# EAGLE design DC_brake(PIC) (EAGLE 7.4.0)
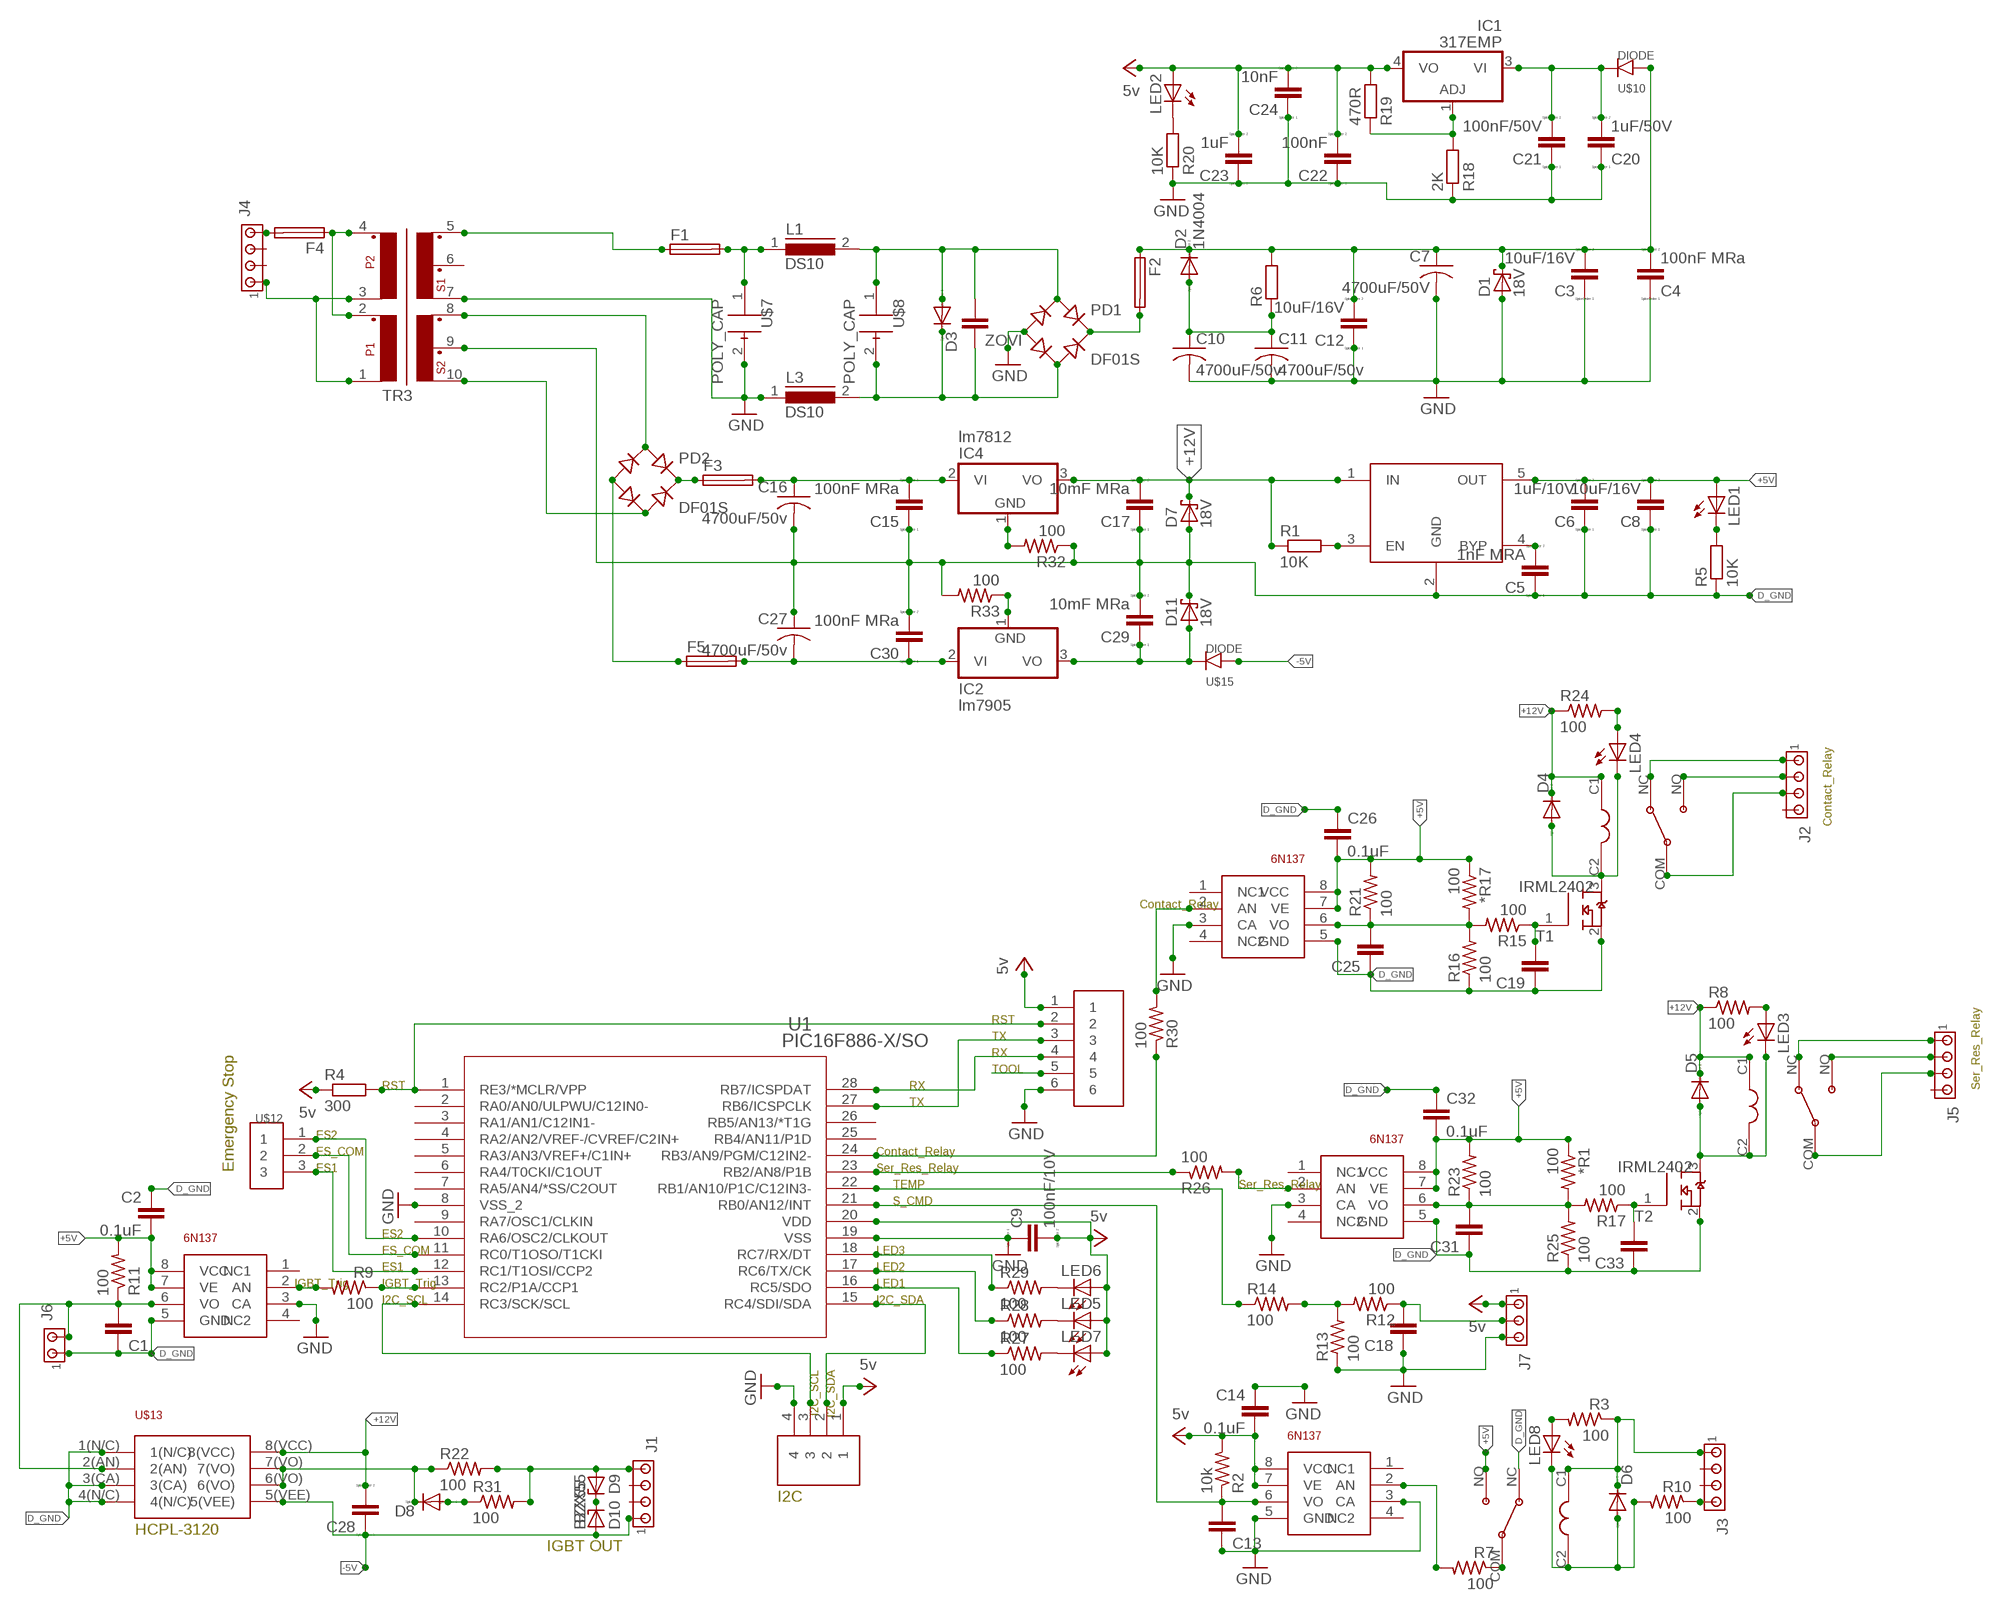
[diagram p0: schematic, sheet 1]

## Parts
*R1  100  R-US_R0603  [R0603]
*R17  100  R-US_R0603  [R0603]
C1  C-EUC0603  [C0603]
C2  0.1uF  C-EUC0603  [C0603]
C3  10uF/16V  CC1206  [C1206]
C4  100nF MRa  CC0603  [C0603]
C5  1nF MRA  CC0603  [C0603]
C6  1uF/10V  CC0603  [C0603]
C7  4700uF/50V  C-US050-075X075  [C050-075X075]
C8  10uF/16V  CC1206  [C1206]
C9  100nF/10V  CC0603  [C0603]
C10  4700uF/50v  C-US050-075X075  [C050-075X075]
C11  4700uF/50v  C-US050-075X075  [C050-075X075]
C12  10uF/16V  CC1206  [C1206]
C13  C-EUC0603  [C0603]
C14  0.1uF  C-EUC0603  [C0603]
C15  100nF MRa  CC0603  [C0603]
C16  4700uF/50v  C-US050-075X075  [C050-075X075]
C17  10mF MRa  CC0603  [C0603]
C18  C-EUC0603  [C0603]
C19  C-EUC0603  [C0603]
C20  1uF/50V  CC1206  [C1206]
C21  100nF/50V  CC0603  [C0603]
C22  100nF  CC0603  [C0603]
C23  1uF  CC0603  [C0603]
C24  10nF  CC0603  [C0603]
C25  C-EUC0603  [C0603]
C26  0.1uF  C-EUC0603  [C0603]
C27  4700uF/50v  C-US050-075X075  [C050-075X075]
C28  C  [C0805]
C29  10mF MRa  CC0603  [C0603]
C30  100nF MRa  CC0603  [C0603]
C31  C-EUC0603  [C0603]
C32  0.1uF  C-EUC0603  [C0603]
C33  C-EUC0603  [C0603]
D1  18V  SCHOTTKY-DIODESMC  [SMC]
D2  1N4004  [DO41-10]
D3  1N4933  [DO41-10]
D4  DIODE-DO214AC  [DO214AC]
D5  DIODE-DO214AC  [DO214AC]
D6  DIODE-DO214AC  [DO214AC]
D7  18V  SCHOTTKY-DIODESMC  [SMC]
D8  DIODE-DO214AC  [DO214AC]
D9  BZX55  [DO35Z10]
D10  BZX55  [DO35Z10]
D11  18V  SCHOTTKY-DIODESMC  [SMC]
F1  19560  [19560]
F2  19560  [19560]
F3  19560  [19560]
F4  19560  [19560]
F5  19560  [19560]
IC1  317EMP  [SOT223]
IC2  lm7905  7908T  [TO220H]
IC4  lm7812  7908T  [TO220H]
J1  MTA04-156  [1X4MTA]
J2  MTA04-156  [1X4MTA]
J3  MTA04-156  [1X4MTA]
J4  MTA04-156  [1X4MTA]
J5  MTA04-156  [1X4MTA]
J6  MTA02-100  [10X02MTA]
J7  MTA03-100  [10X03MTA]
L1  DS10  [DS10]
L3  DS10  [DS10]
LED1  LEDSML1206  [SML1206]
LED2  LEDSML1206  [SML1206]
LED3  LED3MM  [LED3MM]
LED4  LED3MM  [LED3MM]
LED5  LED3MM  [LED3MM]
LED6  LED3MM  [LED3MM]
LED7  LED3MM  [LED3MM]
LED8  LED3MM  [LED3MM]
PD1  DF01S  DBLS201G  [DBS]
PD2  DF01S  DBLS201G  [DBS]
R1  10K  R-EU_R0603  [R0603]
R2  10k  R-US_R0603  [R0603]
R3  100  R-US_R0603  [R0603]
R4  300  R-EU_R0603  [R0603]
R5  10K  R-EU_R0603  [R0603]
R6  R-EU_0411/12  [0411/12]
R7  100  R-US_R0603  [R0603]
R8  100  R-US_R0603  [R0603]
R9  100  R-US_R0603  [R0603]
R10  100  R-US_R0603  [R0603]
R11  100  R-US_R0603  [R0603]
R12  100  R-US_R0603  [R0603]
R13  100  R-US_R0603  [R0603]
R14  100  R-US_R0603  [R0603]
R15  100  R-US_R0603  [R0603]
R16  100  R-US_R0603  [R0603]
R17  100  R-US_R0603  [R0603]
R18  2K  R-EU_R0603  [R0603]
R19  470R  R-EU_R0603  [R0603]
R20  10K  R-EU_R0603  [R0603]
R21  100  R-US_R0603  [R0603]
R22  100  R-US_R0603  [R0603]
R23  100  R-US_R0603  [R0603]
R24  100  R-US_R0603  [R0603]
R25  100  R-US_R0603  [R0603]
R26  100  R-US_R0603  [R0603]
R27  100  R-US_R0603  [R0603]
R28  100  R-US_R0603  [R0603]
R29  100  R-US_R0603  [R0603]
R30  100  R-US_R0603  [R0603]
R31  100  R-US_R0603  [R0603]
R32  100  R-US_R0603  [R0603]
R33  100  R-US_R0603  [R0603]
T1  IRML2402  [IRML2402]
T2  IRML2402  [IRML2402]
TR3  OB115/6M  [OB115/6M]
U1  PIC16F886-X/SO  PIC16F883-X/SO  [SOIC28-W_MC]
U$1  MIC5205-5.YMS  [SMD]
U$2  6N137  [6N137]
U$3  6N137  [6N137]
U$4  6PIN  [6PIN]
U$5  RELAY  [RELAY]
U$6  4PIN  [4PIN]
U$7  POLY_CAP  [POL_CAP]
U$8  POLY_CAP  [POL_CAP]
U$9  RELAY  [RELAY]
U$10  DIODE  [DIODE]
U$11  6N137  [6N137]
U$12  3PIN  [3PIN]
U$13  HCPL-3120  [HCPL-3120]
U$14  6N137  [6N137]
U$15  DIODE  [DIODE]
U$16  RELAY  [RELAY]
ZOVI  C5/7.2  [C5B7.2]

## Nets
+5V: *R1.1 *R17.1 C2.2 C6.2 C8.2 C26.2 C32.2 LED1.A R11.2 R21.2 R23.2 U$1.5(OUT) U$3.7(VE) U$3.8(VCC) U$5.NO U$11.7(VE) U$11.8(VCC) U$14.7(VE) U$14.8(VCC)
+12V: C17.2 C28.2 D4.C D5.C D7.C IC4.3(VO) R1.1 R8.1 R24.1 U$1.1(IN) U$9.C1 U$13.8(VCC) U$16.C1
-5V: C28.1 D10.A J1.1 U$13.5(VEE) U$15.-(+)
CONTACT_RELAY: R30.1 U1.24(RB3/AN9/PGM/C12IN2-)
D_GND: C1.1 C2.1 C5.1 C6.1 C8.1 C15.1 C16.2 C17.1 C19.1 C25.1 C26.1 C27.1 C29.2 C30.2 C31.1 C32.1 C33.1 D7.A D11.C J6.1 R5.1 R16.1 R25.1 R32.1 R33.2 T1.2(S1) T2.2(S1) TR3.9 U$1.2(GND) U$3.5(GND) U$5.NC U$11.5(GND) U$13.1(N/C) U$13.3(CA) U$13.4(N/C) U$14.5(GND)
ES1: U1.12(RC1/T1OSI/CCP2) U$12.3
ES2: U1.10(RA6/OSC2/CLKOUT) U$12.1
ES_COM: U1.11(RC0/T1OSO/T1CKI) U$12.2
GND: C3.1 C4.1 C7.2 C9.1 C10.2 C11.2 C12.1 C13.1 C14.1 C18.1 C20.1 C21.1 C22.1 C23.1 C24.1 D1.A J7.3 L3.1 PD1.- R13.1 R18.1 R20.1 TR3.7 U1.8(VSS_2) U1.19(VSS) U$2.3(CA) U$2.5(GND) U$3.3(CA) U$4.6 U$6.4 U$7.2 U$11.3(CA) U$14.3(CA)
I2C_SCL: U1.14(RC3/SCK/SCL) U$6.3
I2C_SDA: U1.15(RC4/SDI/SDA) U$6.2
IGBT_TRIG: R9.1 U1.13(RC2/P1A/CCP1)
LED1: R27.1 U1.16(RC5/SDO)
LED2: R28.1 U1.17(RC6/TX/CK)
LED3: R29.1 U1.18(RC7/RX/DT)
N$1: C29.1 D11.A IC2.3(VO) U$15.+(-)
N$2: C5.2 U$1.4(BYP)
N$3: F1.2 L1.1 U$7.1
N$4: R1.2 U$1.3(EN)
N$5: F4.1 TR3.2 TR3.4
N$6: F1.1 TR3.5
N$7: J4.1 TR3.1 TR3.3
N$8: F4.2 J4.4
N$9: D9.A J1.4 R22.2 R31.2
N$10: C10.1 C11.1 D2.A R6.1
N$11: PD2.AC2 TR3.10
N$12: J2.1 U$9.NC
N$13: C3.2 C4.2 C7.1 C12.2 D1.C D2.C F2.1 R6.2 U$10.-(+)
N$14: LED1.C R5.2
N$15: D6.A LED8.K(C) R10.2 U$5.C2
N$16: LED8.A R3.2
N$17: R7.2 U$2.2(AN)
N$18: R7.1 U$5.COM
N$19: D6.C J3.1 R3.1 U$5.C1
N$20: D5.A LED3.K(C) T2.3(D1) U$16.C2
N$21: LED3.A R8.2
N$22: J5.1 U$16.NC
N$23: J5.2 U$16.NO
N$24: J5.3 U$16.COM
N$25: R9.2 U$3.2(AN)
N$26: PD2.AC1 TR3.8
N$27: D3.A L1.2 PD1.AC1 U$8.1 ZOVI.2
N$28: D3.C L3.2 PD1.AC2 U$8.2 ZOVI.1
N$29: C27.2 C30.1 F5.2 IC2.2(VI)
N$30: J2.2 U$9.NO
N$31: C1.2 J6.2 R11.1 U$3.6(VO) U$13.2(AN)
N$32: C15.2 C16.1 F3.2 IC4.2(VI)
N$33: C18.2 J7.2 R12.1
N$34: J2.3 U$9.COM
N$35: F2.2 PD1.+
N$36: R26.2 U$14.2(AN)
N$37: R12.2 R13.2 R14.2
N$38: C19.2 R15.1 T1.1(G1)
N$39: D4.A LED4.K(C) T1.3(D1) U$9.C2
N$40: C33.2 R17.1 T2.1(G1)
N$41: *R17.2 C25.2 R15.2 R16.2 R21.1 U$11.6(VO)
N$42: LED2.C R20.2
N$43: IC1.1(ADJ) R18.2 R19.1
N$44: C20.2 C21.2 IC1.3(VI) U$10.+(-)
N$45: F5.1 PD2.-
N$46: J3.4 R10.1
N$47: D8.C R22.1 U$13.6(VO) U$13.7(VO)
N$48: *R1.2 C31.2 R17.2 R23.1 R25.2 U$14.6(VO)
N$49: R30.2 U$11.2(AN)
N$50: LED4.A R24.2
N$51: D8.A R31.1
N$52: LED7.K(C) R27.2
N$53: D9.C D10.C
N$54: LED5.K(C) R28.2
N$55: LED6.K(C) R29.2
N$56: F3.1 PD2.+
N$59: IC4.1(GND) R32.2
N$60: IC2.1(GND) R33.1
RST: R4.2 U1.1(RE3/*MCLR/VPP) U$4.2
RX: U1.28(RB7/ICSPDAT) U$4.4
S_CMD: C13.2 R2.1 U1.21(RB0/AN12/INT) U$2.6(VO)
SER_RES_RELAY: R26.1 U1.23(RB2/AN8/P1B)
TEMP: R14.1 U1.22(RB1/AN10/P1C/C12IN3-)
TOOL: U$4.5
TX: U1.27(RB6/ICSPCLK) U$4.3
VCC: C9.2 C14.2 C22.2 C23.2 C24.2 IC1.4(VO) J7.1 LED2.A LED5.A LED6.A LED7.A R2.2 R4.1 R19.2 U1.20(VDD) U$2.7(VE) U$2.8(VCC) U$4.1 U$6.1 ; supply symbol labelled 5v
Unconnected: J1.2 J1.3 J2.4 J3.2 J3.3 J4.2 J4.3 J5.4 TR3.6 U1.2(RA0/AN0/ULPWU/C12IN0-) U1.3(RA1/AN1/C12IN1-) U1.4(RA2/AN2/VREF-/CVREF/C2IN+) U1.5(RA3/AN3/VREF+/C1IN+) U1.6(RA4/T0CKI/C1OUT) U1.7(RA5/AN4/*SS/C2OUT) U1.9(RA7/OSC1/CLKIN) U1.25(RB4/AN11/P1D) U1.26(RB5/AN13/*T1G) U$2.1(NC1) U$2.4(NC2) U$3.1(NC1) U$3.4(NC2) U$11.1(NC1) U$11.4(NC2) U$14.1(NC1) U$14.4(NC2)

## Notes on the sheet
- Contact_Relay
- Contact_Relay
- RST
- TX
- RX
- TOOL
- RST | RX | Ser_Res_Relay
- TX
- ES2
- ES_COM | Contact_Relay
- Emergency Stop | ES1 | Ser_Res_Relay
- TEMP | Ser_Res_Relay
- S_CMD
- ES2
- ES_COM | LED3
- ES1 | LED2
- IGBT_Trig | IGBT_Trig | LED1
- I2C_SCL | I2C_SDA
- I2C_SCL | I2C_SDA
- I2C
- HCPL-3120
- IGBT OUT

## Library data of the parts
*R1 *R17 R2 R3 R7-R17 R21-R33 = resistor:R-US_: RESISTOR, American symbol
C1 C2 C13 C14 C18 C19 C25 C26 C31-C33 = rcl:C-EU: CAPACITOR, European symbol
C3-C6 C8 C9 C12 C15 C17 C20-C24 C28-C30 = eagle-ltspice:C: CAPACITOR, European symbol; SPICEMODEL: NONE; SPICEPREFIX: C
C7 C10 C11 C16 C27 = rcl:C-US: CAPACITOR, American symbol
D1 D7 D11 = diode:SCHOTTKY-DIODE: Schottky Diode
D2 = diode:1N4004: DIODE general purpose rectifier, 1 A
D3 = diode:1N4933: DIODE fast recovery rectifier, 1A
D4-D6 D8 = diode:DIODE-: DIODE
D9 D10 = diode:BZX55: Z DIODE
F1-F5 = fuse:19560: FUSE HOLDER TR5, Wickmann; MPN: 56000001009; OC_FARNELL: 1185363; OC_NEWARK: 15P8392
IC1 = linear:*317: Positive VOLTAGE REGULATOR
IC2 IC4 = linear:79*: Negative VOLTAGE REGULATOR
J1-J5 = con-amp:MTA04-156: AMP connector
J6 = con-amp:MTA02-100: AMP connector
J7 = con-amp:MTA03-100: AMP connector
L1 L3 = inductors:DS10: INDUCTOR
LED1-LED8 = led:LED: LED OSRAM: - CHIPLED LG R971, LG N971, LY N971, LG Q971, LY Q971, LO R971, LY R971 LH N974, LH R974 LS Q976, LO Q976, LY Q976 LO Q996 - Hyper CHIPLED LW Q18S LB Q993, LB Q99A, LB R99A - SideLED LS A670, LO A670, LY A670, LG A670, LP A670 LB A673, LV A673, LT A673, LW A673 LH A674 LY A675 LS A676, LA A676, LO A676, LY A676, LW A676 LS A679, LY A679, LG A679 - Hyper Micro SIDELED® LS Y876, LA Y876, LO Y876, LY Y876 LT Y87S - SmartLED LW L88C, LW L88S LB L89C, LB L89S, LG L890 LS L89K, LO L89K, LY L89K LS L896, LA L896, LO L896, LY L896 - TOPLED LS T670, LO T670, LY T670, LG T670, LP T670 LSG T670, LSP T670, LSY T670, LOP T670, LYG T670 LG T671, LOG T671, LSG T671 LB T673, LV T673, LT T673, LW T673 LH T674 LS T676, LA T676, LO T676, LY T676, LB T676, LH T676, LSB T676, LW T676 LB T67C, LV T67C, LT T67C, LS T67K, LO T67K, LY T67K, LW E67C LS E67B, LA E67B, LO E67B, LY E67B, LB E67C, LV E67C, LT E67C LW T67C LS T679, LY T679, LG T679 LS T770, LO T770, LY T770, LG T770, LP T770 LB T773, LV T773, LT T773, LW T773 LH T774 LS E675, LA E675, LY E675, LS T675 LS T776, LA T776, LO T776, LY T776, LB T776 LHGB T686 LT T68C, LB T68C - Hyper Mini TOPLED® LB M676 - Mini TOPLED Santana® LG M470 LS M47K, LO M47K, LY M47K Source: http://www.osram.convergy.de LUXEON: - LUMILED® LXK2-PW12-R00, LXK2-PW12-S00, LXK2-PW14-U00, LXK2-PW14-V00 LXK2-PM12-R00, LXK2-PM12-S00, LXK2-PM14-U00 LXK2-PE12-Q00, LXK2-PE12-R00, LXK2-PE12-S00, LXK2-PE14-T00, LXK2-PE14-U00 LXK2-PB12-K00, LXK2-PB12-L00, LXK2-PB12-M00, LXK2-PB14-N00, LXK2-PB14-P00, LXK2-PB14-Q00 LXK2-PR12-L00, LXK2-PR12-M00, LXK2-PR14-Q00, LXK2-PR14-R00 LXK2-PD12-Q00, LXK2-PD12-R00, LXK2-PD12-S00 LXK2-PH12-R00, LXK2-PH12-S00 LXK2-PL12-P00, LXK2-PL12-Q00, LXK2-PL12-R00 Source: www.luxeon.com KINGBRIGHT: KA-3528ASYC Source: www.kingbright.com
PD1 PD2 = rectifier:DB?*G: Single Phase 1.0 AMP Glass Passivated Bridge Rectifier Taiwan Semiconductor Co.,Ltd. - TSC Source: http://www.taiwansemi.com/TSCbig5/ezcatfiles/cust/img/img/db101g.pdf http://www.ts.com.tw/db/pictures/modules/PDT/PDT060207001/DBLS201G.pdf
R1 R4 R5 R18-R20 = rcl:R-EU_: RESISTOR, European symbol
R6 = resistor:R-EU_: RESISTOR, European symbol
T1 T2 = irlml2402:IRML2402
TR3 = trafo:OB115/6M: TRANSFORMER 2 primary winding, 2 secondary windings with tap, mounting holes BLOCK
U1 = pic16f883:PIC16F883-X/SO
U$1 = mic5205_5.0:MIC5205-5.YMS
U$2 U$3 U$11 U$14 = 6n137:6N137
U$4 = 6pin:6PIN
U$5 U$9 U$16 = relay:RELAY
U$6 = 4pin:4PIN
U$7 U$8 = poly_cap:POLY_CAP
U$10 U$15 = diode:DIODE
U$12 = 3pin:3PIN
U$13 = hcpl_3120:HCPL-3120
ZOVI = capacitor-wima:C: CAPACITOR naming: grid - package width

## Board
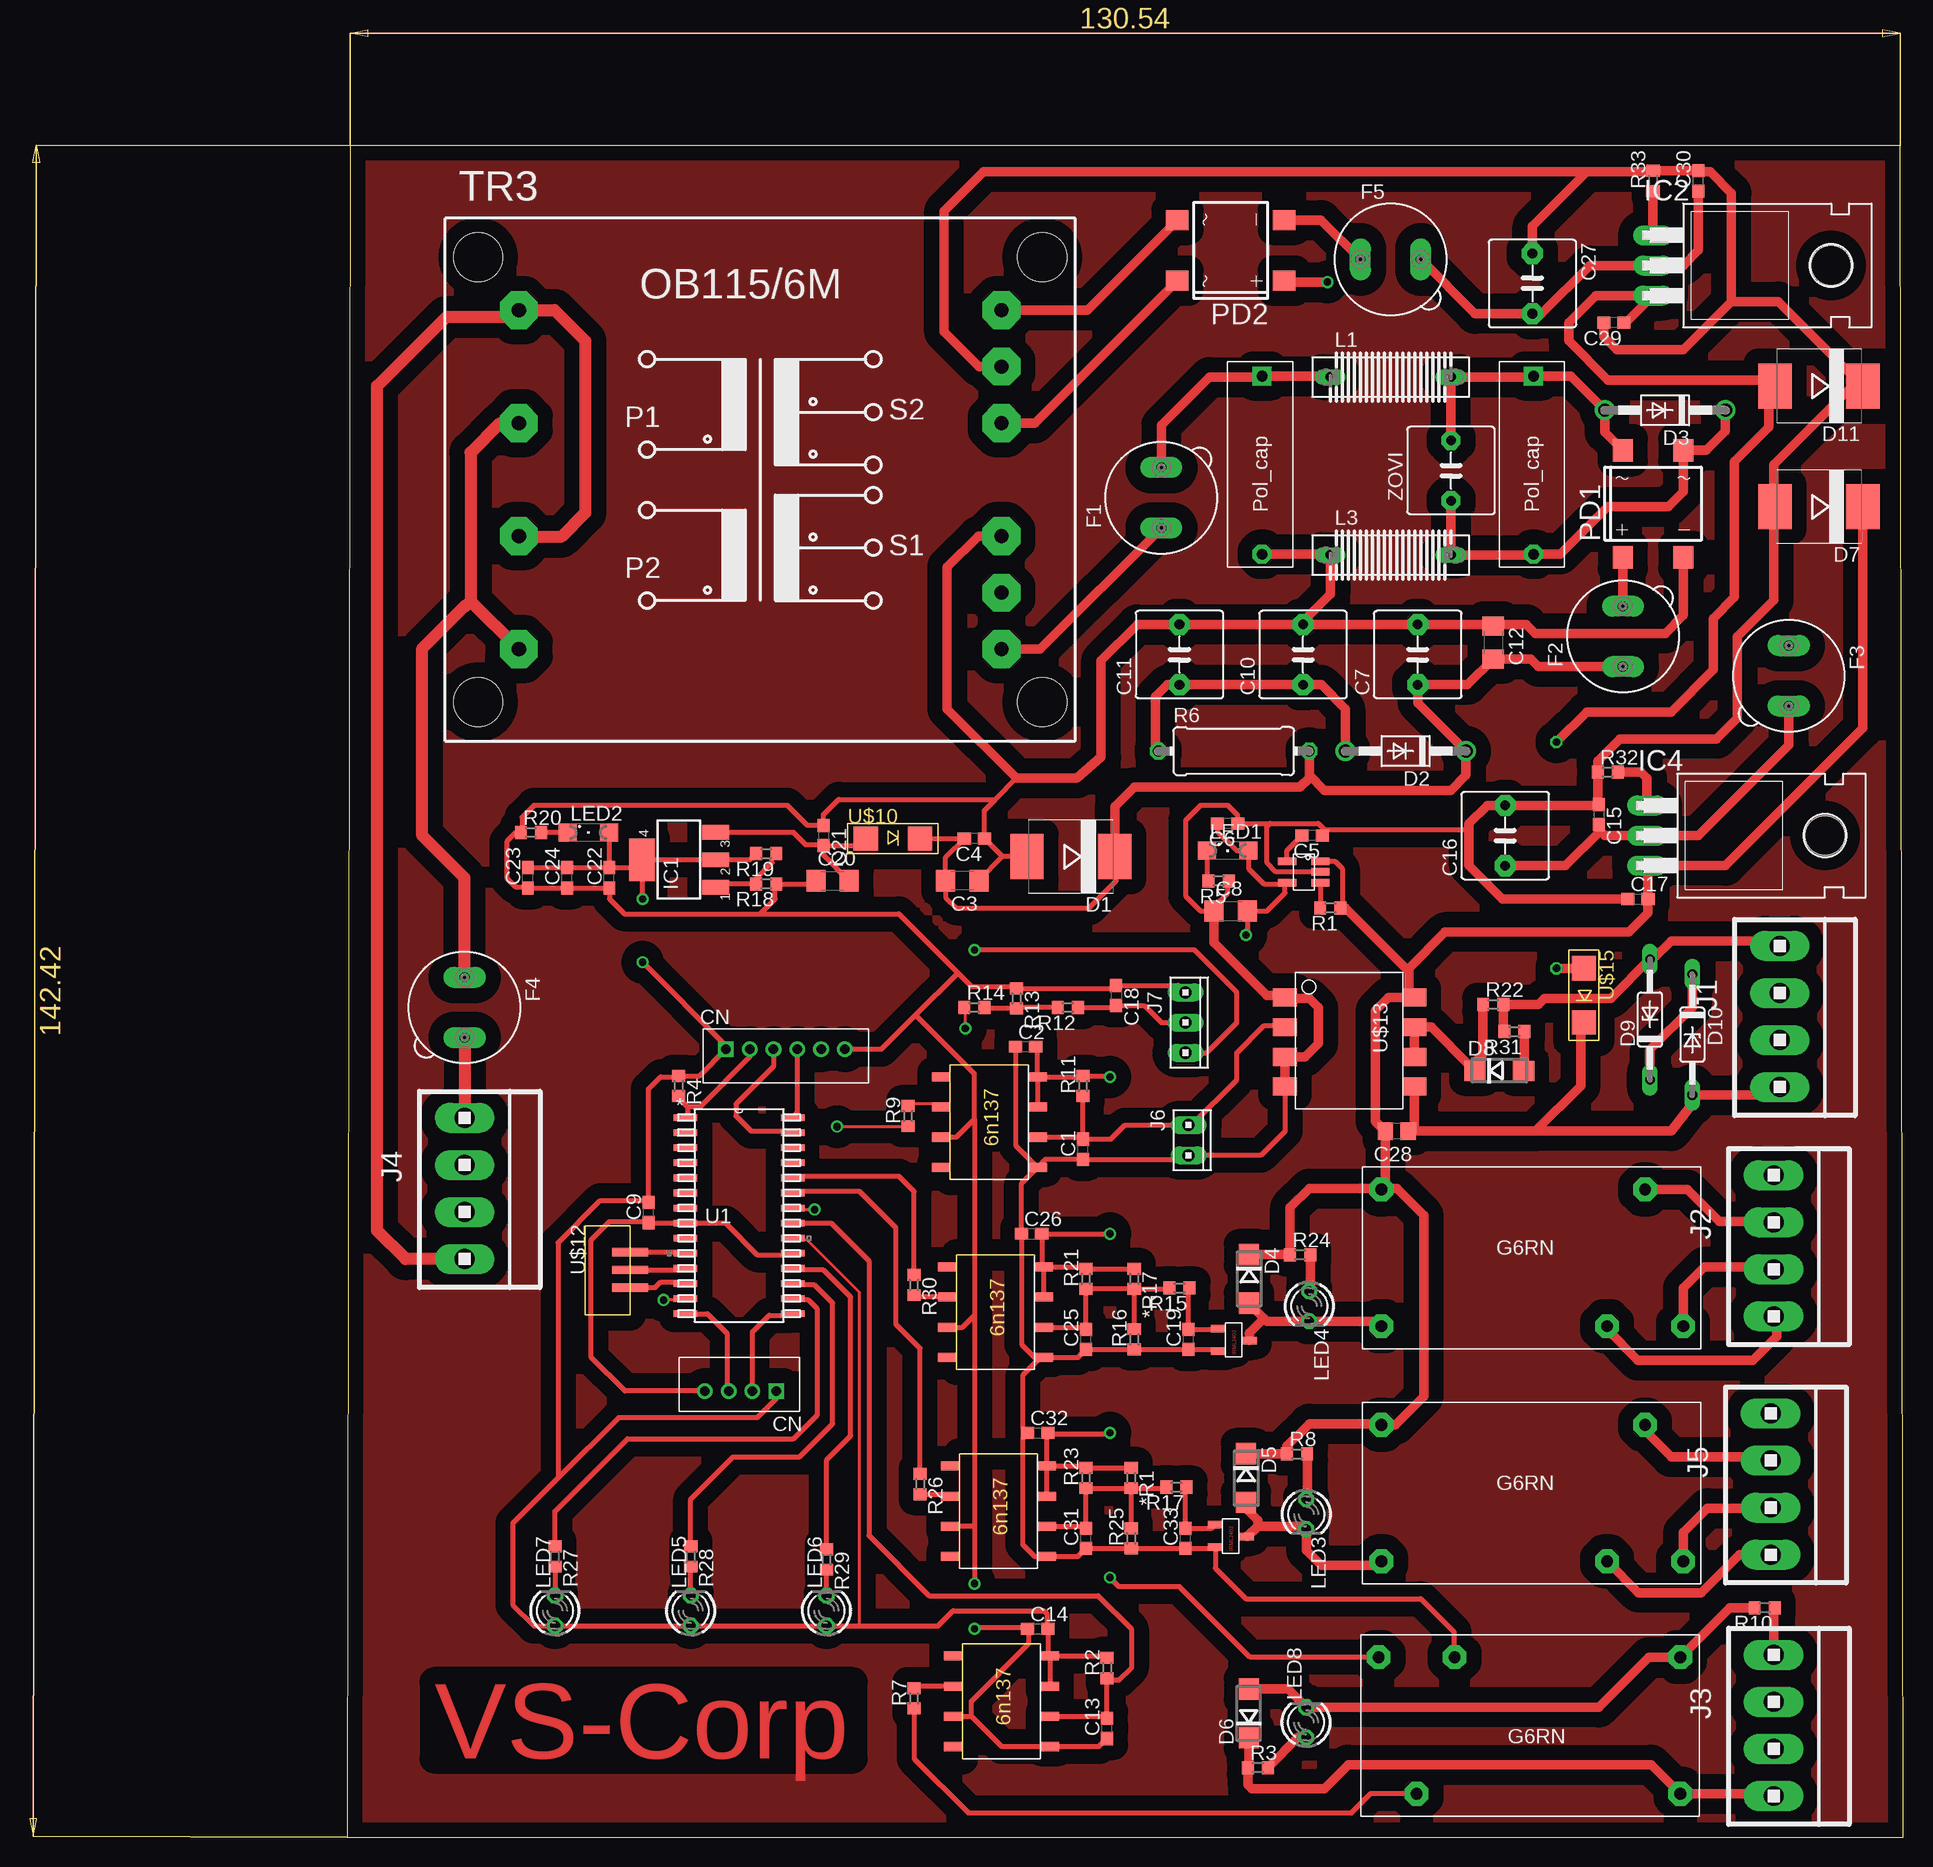
[diagram p1: board, top side]
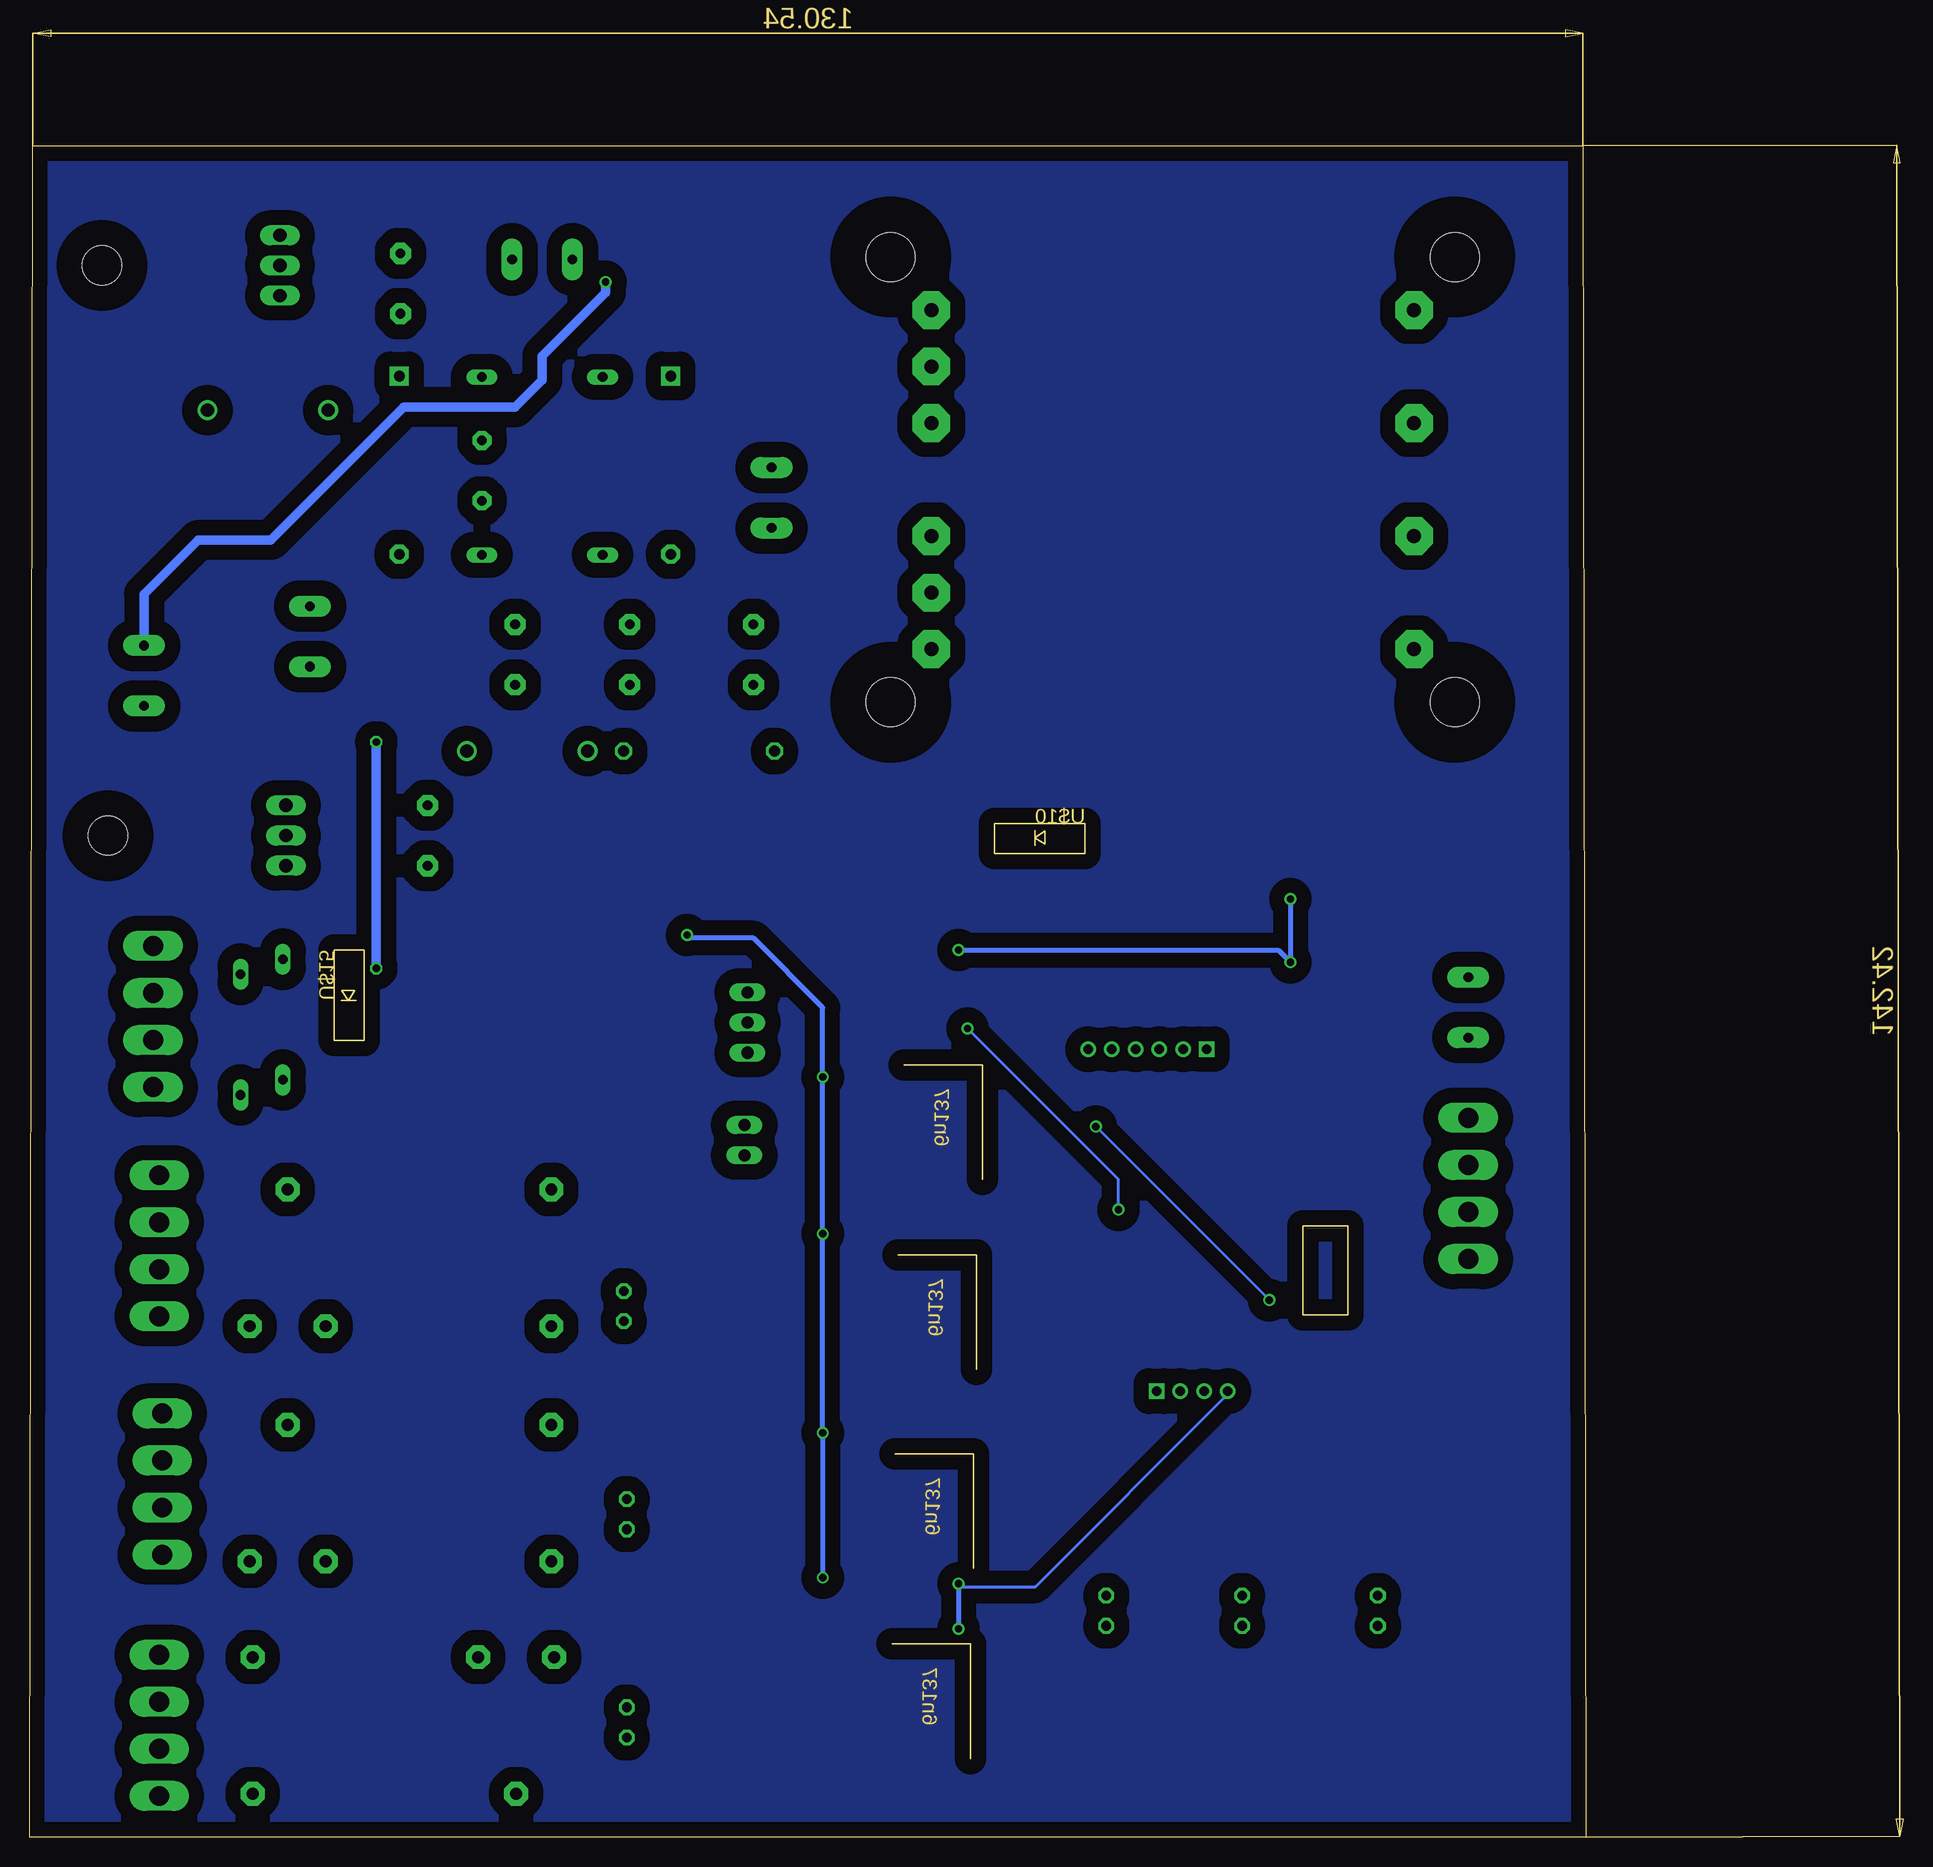
[diagram p2: board, bottom side, seen from below]

Size 131.04 x 142.42 mm. Coordinates in mm from the lower left corner, seen from the top.
Outline: 0,0 131.04,0 130.79,142.42 0.25,142.42 0,0
Copper layers (1*16): Top 0.035mm / dielectric 1.5mm / Bottom 0.035mm
Design rules "default": minimum track width 10mil, minimum drill 24mil, track to track 8mil, track to pad 8mil, pad to pad 8mil, via to via 8mil, smd to smd 8mil, copper to edge 40mil, drill to drill 8mil, minimum pad ring 10mil, minimum via ring 8mil, stop-mask expansion 4mil, vias tented up to drill 0mil, thermal gap 10mil

### Footprints (pad centres in the part's own frame; a part is rotated, then mirrored left to right if it is on the bottom)
R0603 = smd 1 x 1.1: 1 -0.85,0; 2 0.85,0
C0603 = smd 1.1 x 1: 1 -0.85,0; 2 0.85,0
C1206 = smd 1.6 x 1.8: 1 -1.4,0; 2 1.4,0
C050-075X075 = drill 0.813 pad 1.778 octagon: 1 -2.54,0; 2 2.54,0
C0805 = smd 1.3 x 1.5: 1 -0.95,0; 2 0.95,0
SMC = smd 2.8 x 3.8: A 3.7,0; C -3.7,0
DO41-10 = drill 1.118: A 5.08,0; C -5.08,0
DO214AC = smd 1.8 x 1.7: A 2.05,0; C -2.05,0
DO35Z10 = drill 0.813 long: A 5.08,0; C -5.08,0
19560 = drill 0.813 pad 1.778 long: 1 -2.54,0; 2 2.54,0
SOT223 = smd 1.219 x 2.235: 1 -2.311,-3.099; 2 0,-3.099; 3 2.311,-3.099 | smd 3.6 x 2.2: 4 0,3.099
TO220H = drill 1.118 long: 1 -2.54,-10.16; 2 0,-10.16; 3 2.54,-10.16 | hole 3.302: 0,4.826
1X4MTA = drill 1.676 long: 1 5.944,0; 2 1.981,0; 3 -1.981,0; 4 -5.944,0
10X02MTA = drill 1.016 long: 1 1.27,0; 2 -1.27,0
10X03MTA = drill 1.016 long: 1 2.54,0; 2 0,0; 3 -2.54,0
DS10 = drill 0.813 long: 1 -5.08,0; 2 5.08,0
SML1206 = smd 1.5 x 1.5: A 1.75,0; C -1.75,0
LED3MM = drill 0.813 octagon: A -1.27,0; K 1.27,0
DBS = smd 1.7 x 1.9: + -2.55,-4.5; - 2.55,-4.5; AC1 -2.55,4.5; AC2 2.55,4.5
0411/12 = drill 0.914 octagon: 1 -6.35,0; 2 6.35,0
IRML2402 = smd 0.635 x 1.27: 1 -0.9,-1.3; 2 1,-1.3; 3 0.1,1.3
OB115/6M = drill 1.194 pad 3.175 octagon: 1 -20.32,14.275; 2 -20.32,4.75; 3 -20.32,-4.75; 4 -20.32,-14.275; 5 20.32,-14.275; 6 20.32,-9.525; 7 20.32,-4.75; 8 20.32,4.75; 9 20.32,9.525; 10 20.32,14.275 | hole 4.115: 23.749,18.745; 23.749,-18.745; -23.749,-18.745; -23.749,18.745
SOIC28-W_MC = smd 1.981 x 0.559: 1 -4.515,8.255; 2 -4.515,6.985; 3 -4.515,5.715; 4 -4.515,4.445; 5 -4.515,3.175; 6 -4.515,1.905; 7 -4.515,0.635; 8 -4.515,-0.635; 9 -4.515,-1.905; 10 -4.515,-3.175; 11 -4.515,-4.445; 12 -4.515,-5.715; 13 -4.515,-6.985; 14 -4.515,-8.255; 15 4.515,-8.255; 16 4.515,-6.985; 17 4.515,-5.715; 18 4.515,-4.445; 19 4.515,-3.175; 20 4.515,-1.905; 21 4.515,-0.635; 22 4.515,0.635; 23 4.515,1.905; 24 4.515,3.175; 25 4.515,4.445; 26 4.515,5.715; 27 4.515,6.985; 28 4.515,8.255
SMD = smd 0.635 x 1.524: 1 -0.89,1.454; 2 0.01,1.454; 3 0.91,1.454; 4 -0.89,-1.346; 5 0.91,-1.346
6N137 = smd 1.524 x 0.762: 1 -4.064,3.556; 2 -4.064,1.016; 3 -4.064,-1.524; 4 -4.064,-4.064; 5 4.064,-4.064; 6 4.064,-1.524; 7 4.064,1.016; 8 4.064,3.556
6PIN = drill 0.8 square: 1 -4.4,0.3 | drill 0.8: 2 -2.4,0.3; 3 -0.4,0.3; 4 1.6,0.3; 5 3.6,0.3; 6 5.6,0.3
RELAY = drill 1 pad 2 octagon: C1 -12.2,5.5; C2 -12.2,-6; COM 10,5.5; NC 6.8,-6; NO 13.2,-6
4PIN = drill 0.8 square: 1 -4.4,0.3 | drill 0.8: 2 -2.4,0.3; 3 -0.4,0.3; 4 1.6,0.3
POL_CAP = drill 0.9 pad 1.6 square: 1 -7.7,0.1 | drill 0.9 pad 1.6 octagon: 2 7.3,0.1
DIODE = smd 2.032 x 2.032: + -2.286,0; - 2.286,0
3PIN = smd 0.7 x 3: 1 -1.508,2.501; 2 -0.008,2.501; 3 1.492,2.501
HCPL-3120 = smd 1.5 x 2: 1(N/C) -4.654,-4.829; 2(AN) -2.154,-4.829; 3(CA) 0.346,-4.829; 4(N/C) 2.846,-4.829; 5(VEE) 2.846,6.071; 6(VO) 0.346,6.071; 7(VO) -2.154,6.071; 8(VCC) -4.654,6.071
C5B7.2 = drill 0.813 pad 1.6 octagon: 1 -2.54,0; 2 2.54,0

### Placement (x,y rotation side)
*R1  66.04,30.23 270 top
*R17  66.29,46.99 270 top
C1  61.98,57.91 90 top
C2  57.15,66.55 0 top
C3  51.82,80.52 180 top
C4  52.83,84.07 180 top
C5  81.28,84.33 180 top
C6  74.17,85.34 180 top
C7  90.17,99.57 90 top
C8  74.42,77.98 0 top
C9  25.4,52.58 90 top
C10  80.52,99.57 90 top
C11  70.1,99.57 90 top
C12  96.52,100.58 270 top
C13  64.01,9.14 90 top
C14  58.17,17.53 0 top
C15  105.41,86.11 270 top
C16  97.54,84.33 90 top
C17  108.71,78.99 0 top
C18  64.77,70.87 270 top
C19  70.87,41.91 90 top
C20  40.89,80.52 0 top
C21  40.13,84.33 270 top
C22  22.1,80.77 90 top
C23  15.24,80.77 90 top
C24  18.54,80.77 90 top
C25  62.23,41.91 90 top
C26  57.66,50.8 0 top
C27  99.82,130.81 270 top
C28  88.39,59.44 180 top
C29  106.68,127.51 180 top
C30  113.79,139.45 90 top
C31  62.23,25.15 90 top
C32  58.17,34.04 0 top
C33  70.61,25.15 90 top
D1  60.96,82.55 180 top
D2  89.15,91.44 180 top
D3  111,120.14 180 top
D4  75.95,46.99 270 top
D5  75.69,30.23 270 top
D6  75.95,10.41 90 top
D7  123.95,112.01 180 top
D8  97.03,64.52 0 top
D9  109.73,68.83 90 top
D10  113.28,67.56 270 top
D11  123.95,122.17 180 top
F1  68.58,112.78 90 top
F2  107.44,101.09 90 top
F3  121.41,97.79 270 top
F4  9.91,69.85 270 top
F5  87.88,132.84 0 top
IC1  27.94,82.3 90 top
IC2  120.14,132.33 270 top
IC4  119.63,84.33 270 top
J1  120.65,69.09 270 top
J2  120.14,49.78 270 top
J3  120.14,9.4 270 top
J4  9.91,54.61 270 top
J5  119.89,29.72 270 top
J6  70.87,58.67 270 top
J7  70.61,68.58 270 top
L1  87.88,122.94 0 top
L3  87.88,107.95 0 top
LED1  74.17,83.06 0 top
LED2  20.32,84.58 0 top
LED3  80.77,27.18 270 top
LED4  81.03,44.7 270 top
LED5  28.96,19.05 90 top
LED6  40.39,19.05 90 top
LED7  17.53,19.05 90 top
LED8  80.77,9.65 90 top
PD1  109.98,112.27 0 top
PD2  74.42,133.6 90 top
R1  82.8,78.23 180 top
R2  64.01,14.22 90 top
R3  76.71,5.84 0 top
R4  27.94,63.25 270 top
R5  73.41,80.52 180 top
R6  74.68,91.44 0 top
R7  47.75,11.68 90 top
R8  80.01,32.26 0 top
R9  47.24,60.71 90 top
R10  119.38,19.3 180 top
R11  61.98,63.25 90 top
R12  60.71,69.85 180 top
R13  56.39,70.61 270 top
R14  52.83,69.85 0 top
R15  70.1,46.23 180 top
R16  66.29,41.91 90 top
R17  69.85,29.46 180 top
R18  35.31,80.26 180 top
R19  35.31,82.8 180 top
R20  15.49,84.58 0 top
R21  62.23,46.99 90 top
R22  96.52,70.1 0 top
R23  62.23,30.23 90 top
R24  80.26,49.02 0 top
R25  66.04,25.15 90 top
R26  48.26,29.72 270 top
R27  17.53,23.62 270 top
R28  28.96,23.62 270 top
R29  40.39,23.37 270 top
R30  47.75,46.48 270 top
R31  98.3,67.82 180 top
R32  106.17,89.66 0 top
R33  109.98,139.45 90 top
T1  74.68,41.91 270 top
T2  74.42,25.4 270 top
TR3  34.8,114.3 0 top
U1  33.02,52.32 0 top
U$1  80.52,81.28 270 top
U$2  55.12,11.68 0 top
U$3  54.1,60.45 0 top
U$4  36.32,66.04 0 top
U$5  100.08,9.14 180 top
U$6  31.75,37.85 180 top
U$7  76.96,115.32 270 top
U$8  99.82,115.32 270 top
U$9  99.31,49.02 0 top
U$10  45.97,84.07 0 top
U$11  54.61,44.45 0 top
U$12  21.34,47.75 270 top
U$13  83.82,66.04 270 top
U$14  54.86,27.69 0 top
U$15  104.14,70.87 270 top
U$16  99.31,29.21 0 top
ZOVI  92.96,115.06 90 top

### Tracks (layer width: path | path; a pad name or v marks a point on that pad's centre or on a via)
+5V  (via drill 0.6)
  Top 0.406: C6.2 73.32,84.67 74.93,83.06 LED1.A 75.92,81.56 77.22,80.26 79.07,80.26 U$1.5 78.99,80.19 78.99,79.5 77.47,77.98 C8.2 75.82,76.08 v75.69,75.95 | U$14.7 U$14.8 | U$14.8 62.06,31.24 R23.2 *R1.1 | U$3.8 61.89,64.01 R11.2 64.17,64.1 v64.26,64.01 | U$3.8 58.17,66.38 C2.2 | U$3.8 U$3.7 | U$11.8 62.06,48.01 R21.2 *R17.1 | U$11.7 U$11.8 | U$11.8 58.51,48.17 C26.2 v64.26,50.8 | U$5.NO 76.04,15.14 70.1,21.08 65.02,21.08 v64.26,21.84 | 58.93,33.95 64.17,33.95 v64.26,34.04 | U$14.8 58.93,33.95 | 58.93,33.95 C32.2
  Bottom 0.406: v75.69,75.95 75.44,75.69 70.1,75.69 64.26,69.85 v64.26,64.01 v64.26,50.8 v64.26,34.04 v64.26,21.84
+12V
  Top 0.406: U$1.1 83.18,82.17 83.82,81.53 83.82,78.4 R1.1
  Top 0.813: D7.C 127.65,93.36 116.08,81.79 IC4.3 109.56,81.7 C17.2 109.56,77.81 107.95,76.2 92.46,76.2 89.41,73.15 89.41,72.9 | 89.41,72.9 89.41,71.18 U$13.8(VCC) 87.71,70.69 86.61,69.6 86.61,60.26 C28.2 87.44,54.85 U$9.C1 | R1.1 84.07,78.23 89.41,72.9 | D4.C 79.4,49.04 R24.1 79.41,53 81.03,54.61 87.03,54.61 U$9.C1 | D5.C 75.71,32.26 R8.1 79.16,32.93 81.03,34.8 87.03,34.8 U$16.C1 88.3,34.71 90.68,37.08 90.68,52.32 88.39,54.61 87.2,54.61 U$9.C1
-5V
  Top 0.813: U$13.5(VEE) 89.89,59.98 C28.1 100.08,59.44 | 100.08,59.44 103.89,63.25 103.89,68.33 U$15.- | 100.08,59.44 111.51,59.44 113.28,61.72 D10.A 119.99,62.48 J1.1
CONTACT_RELAY
  Top 0.406: R30.1 47.75,54.36 46.48,55.63 37.66,55.63 U1.24
D_GND
  Top 0.406: 77.72,85.34 C6.1 75.02,86.02 74.17,86.87 71.88,86.87 70.61,85.6 70.61,79.25 71.88,77.98 C8.1 73.02,78.36 74.17,79.5 74.17,80.43 R5.1 | 77.72,85.34 81.79,85.34 82.3,84.84 | 82.3,84.84 82.3,84.49 C5.1 | U$1.2 78.24,81.27 77.47,82.04 77.47,85.09 77.72,85.34 | 82.3,84.84 94.49,84.84 | U$3.5 58.84,57.06 C1.1 70.52,57.06 J6.1 76.96,57.4 78.99,59.43 U$13.4(N/C) | T1.2 73.23,41.06 C19.1 R16.1 C25.1 61.56,40.39 U$11.5 | U$3.5 56.81,55.03 C26.1 56.81,41.49 57.91,40.39 U$11.5 | U$11.5 58.42,40.39 56.9,38.86 56.9,34.46 C32.1 57.32,33.95 56.9,33.53 56.9,24.64 57.91,23.62 U$14.5 61.56,23.62 C31.1 R25.1 C33.1 73.02,24.3 T2.2 73.12,22.64 75.69,20.07 90.42,20.07 93.22,17.27 93.22,15.2 U$5.NC | C2.1 56.3,58.25 U$3.5
  Top 0.813: C27.1 99.82,135.64 104.39,140.21 | 104.39,140.21 109.89,140.21 R33.2 C30.2 113.88,140.21 114.81,140.21 116.59,138.43 116.59,129.29 | TR3.9 53.21,123.83 50.29,126.75 50.29,136.91 53.59,140.21 104.39,140.21 | 116.59,129.29 120.54,129.29 D11.C 126.75,122.17 120.14,115.57 120.14,112.12 | 120.14,112.12 D7.A | C29.2 105.83,126.33 106.93,125.22 112.52,125.22 116.59,129.29 | 120.14,112.12 120.14,104.14 117.09,101.09 117.09,94.23 115.32,92.46 107.19,92.46 105.32,90.59 R32.1 105.32,87.04 C15.1 105.32,86.87 C16.2 96.01,86.87 94.49,85.34 94.49,84.84 94.49,81.79 97.28,78.99 C17.1 | U$13.4(N/C) U$13.3(CA) 80.68,65.69 81.79,66.8 81.79,69.85 81.03,70.61 79.07,70.61 U$13.1(N/C) 78.82,70.87 77.47,70.87 73.02,75.31 C8.1
ES1
  Top 0.406: U$12.3 25.94,46.26 26.42,46.74 28.38,46.74 U1.12
ES2
  Top 0.406: U$12.1 28.39,49.26 U1.10
ES_COM
  Top 0.406: U$12.2 28.39,47.76 U1.11
GND  (via drill 0.6)
  Top 0.406: 54.61,87.38 41.4,87.38 40.13,86.11 C21.1 38.77,85.18 37.08,86.87 15.75,86.87 14.73,85.85 14.73,84.67 R20.1 14.22,84.58 13.46,83.82 13.46,80.77 14.22,80.01 15.15,80.01 C23.1 C24.1 C22.1 22.1,78.99 23.37,77.72 34.8,77.72 | 54.61,87.38 56.39,89.15 | D1.A 55.21,82.55 | 55.21,82.55 C4.1 53.68,86.45 54.61,87.38 | C3.1 53.22,80.56 55.21,82.55 | C20.1 39.24,80.26 R18.1 36.07,80.18 36.07,78.99 34.8,77.72 | 34.8,77.72 46.48,77.72 51.44,72.77 | 51.44,72.77 52.58,71.63 56.22,71.63 R13.1 64.52,71.46 C18.1 70.02,71.72 J7.3 | U1.19 37.41,49.02 34.54,49.02 31.88,51.69 U1.8 28.47,51.73 C9.1 25.31,51.82 22.1,51.82 20.57,50.29 20.57,40.39 23.41,37.55 U$6.4 | U$4.6 45,66.34 47.88,69.22 | 47.88,69.22 51.44,72.77 | U$3.3 51.31,58.93 52.83,60.45 | 52.83,60.45 52.83,64.26 47.88,69.22 | C13.1 63.33,7.62 U$2.5 55.12,7.62 52.58,10.16 | U$2.3 52.58,10.16 | 52.58,10.16 52.58,11.43 57.4,16.26 57.4,17.44 | 57.4,17.44 C14.1 57.4,17.61 | U$11.3 51.82,42.93 52.83,43.94 | 52.83,43.94 52.83,26.16 | 51.56,26.16 U$14.3 52.83,26.16 | 52.83,60.45 52.83,43.94 | 57.4,17.44 57.4,17.61 | 57.4,17.61 57.4,17.78 | 57.4,17.61 52.92,17.61 v52.83,17.53 | 52.83,26.16 v52.83,21.34
  Top 0.813: PD1.- 112.53,102.88 111,101.35 100.08,101.35 99.31,102.11 97.15,102.11 96.9,102.36 C12.1 96.4,102.11 C7.2 C10.2 | C10.2 C11.2 66.55,102.11 63.5,99.06 63.5,90.93 61.47,89.15 56.39,89.15 50.55,95 50.55,106.93 53.16,109.55 TR3.7 | U$7.2 82.74,108.02 L3.1 82.8,104.65 80.52,102.36 C10.2
  Bottom 0.254: U$6.4 30.48,36.96 46.36,21.08 52.7,21.08 v52.83,21.34
  Bottom 0.406: v52.83,21.34 v52.83,17.53
I2C_SCL
  Top 0.406: U1.14 30.35,44.07 32,42.42 32,37.69 U$6.3
I2C_SDA
  Top 0.406: U$6.2 34.15,42.53 35.56,43.94 37.41,43.94 U1.15
IGBT_TRIG  (via drill 0.61)
  Top 0.254: v41.27,59.82 46.99,59.82 R9.1 | v26.67,45.21 27.94,45.21 U1.13
  Bottom 0.254: v26.67,45.21 v41.27,59.82
LED1
  Top 0.406: R27.1 17.53,27.43 23.62,33.53 37.59,33.53 39.62,35.56 39.62,44.45 38.86,45.21 37.66,45.21 U1.16
LED2
  Top 0.406: R28.1 28.96,28.45 32.51,32 38.1,32 40.89,34.8 40.89,44.96 39.37,46.48 37.66,46.48 U1.17
LED3
  Top 0.406: R29.1 40.39,31.75 42.42,33.78 42.42,45.47 40.13,47.75 37.66,47.75 U1.18
N$1  (via drill 0.6)
  Top 0.813: C29.1 107.7,127.51 IC2.3 105.16,129.79 102.87,127.51 102.87,125.98 106.17,122.68 119.74,122.68 | 119.74,122.68 D11.A | 119.74,122.68 119.74,118.73 116.84,115.82 116.84,104.39 115.06,102.62 115.06,98.3 111.51,94.74 104.39,94.74 v101.85,92.2 | U$15.+ v101.85,73.15
  Bottom 0.813: v101.85,92.2 v101.85,73.15
N$2
  Top 0.406: U$1.4 79.17,83.07 C5.2
N$3
  Top 0.813: F1.2 68.58,118.87 72.64,122.94 76.98,122.94 U$7.1 82.72,123.02 L1.1
N$4
  Top 0.406: U$1.3 81.97,78.25 R1.2
N$5
  Top 1.016: TR3.2 12.88,119.05 10.41,116.59 10.41,104.09 | 10.41,104.09 TR3.4 | F4.1 9.91,80.77 6.35,84.33 6.35,100.08 9.91,103.63 9.96,103.63 10.41,104.09
N$6
  Top 0.813: TR3.5 58.37,100.03 F1.1
N$7
  Top 1.016: TR3.3 14.55,109.47 18.03,109.47 20.07,111.51 20.07,125.98 17.48,128.57 TR3.1 13.92,128.02 8.38,128.02 2.54,122.17 2.54,51.05 4.93,48.67 J4.1
N$8
  Top 1.016: F4.2 J4.4
N$9
  Top 0.813: R31.2 97.37,67.9 R22.2 100.33,70.1 100.84,70.61 106.43,70.61 D9.A 109.98,73.91 111.51,75.44 120.24,75.44 J1.4
N$10
  Top 0.813: R6.1 68.07,91.69 68.07,96.01 69.09,97.03 C11.1 C10.1 82.04,97.03 84.07,95 D2.A
N$11
  Top 0.813: TR3.10 62.34,128.57 PD2.AC2
N$12
  Top 0.813: U$9.NC 106.11,42.73 108.71,40.13 118.36,40.13 120.4,42.16 120.4,43.59 J2.1
N$13
  Top 0.406: U$10.- C4.2 50.42,82.51 C3.2 50.42,79.12 51.31,78.23 62.48,78.23 64.77,80.52 64.77,82.44 D1.C | 64.55,85.85 64.66,85.74
  Top 0.813: D1.C 64.66,85.74 64.66,86.76 66.29,88.39 80.26,88.39 81.03,89.15 R6.2 81.03,89.41 82.3,88.14 92.96,88.14 94.23,89.41 D2.C 90.17,95.5 C7.1 94.36,97.03 C12.2 99.7,99.18 100.33,98.55 F2.1
N$14
  Top 0.406: LED1.C 72.42,80.66 R5.2
N$15
  Top 0.813: R10.2 116.44,19.3 U$5.C2 109.63,15.14 105.41,10.92 LED8.K 79.23,12.46 D6.A
N$16
  Top 0.813: LED8.A 80.1,8.38 R3.2
N$17
  Top 0.406: U$2.2 47.92,12.7 R7.2
N$18
  Top 0.406: U$5.COM 86.19,3.64 84.58,2.03 52.32,2.03 47.75,6.6 R7.1
N$19
  Top 0.813: D6.C 75.95,5.93 R3.1 75.86,4.41 76.2,4.06 82.3,4.06 84.33,6.1 109.82,6.1 U$5.C1 119.95,3.64 J3.1
N$20
  Top 0.813: T2.3 75.85,25.3 76.71,26.16 | 76.71,26.16 80.52,26.16 LED3.K 80.77,24.13 82.04,22.86 86.76,22.86 U$16.C2 | 76.71,26.16 76.71,26.67 75.69,27.69 D5.A
N$21
  Top 0.813: R8.2 80.86,28.54 LED3.A
N$22
  Top 0.813: J5.1 117.25,23.77 114.05,20.57 108.75,20.57 U$16.NC
N$23
  Top 0.813: U$16.NO 112.51,25.65 114.55,27.69 119.84,27.69 J5.2
N$24
  Top 0.813: U$16.COM 109.31,34.2 111.51,32 119.58,32 J5.3
N$25
  Top 0.254: R9.2 47.62,61.72 49.53,61.72 U$3.2
N$26
  Top 0.813: TR3.8 57.92,119.05 PD2.AC1
N$27
  Top 0.813: ZOVI.2 L1.2 99.84,122.94 U$8.1 103.04,123.02 D3.A 105.92,118.28 PD1.AC1
N$28
  Top 0.813: PD1.AC2 113.03,116.77 | 113.03,116.77 114.48,116.77 116.08,118.36 D3.C | 113.03,116.77 112.52,116.26 112.52,113.28 111.25,112.01 106.17,112.01 102.17,108.02 U$8.2 99.86,107.95 L3.2 ZOVI.1
N$29
  Top 0.813: C30.1 113.79,133.6 112.52,132.33 IC2.2 104.65,132.33 100.58,128.27 C27.2 95,128.27 F5.2
N$30
  Top 0.813: U$9.NO 112.51,46.22 114.3,48.01 119.94,48.01 J2.2
N$31
  Top 0.406: U$3.6 61.81,58.93 C1.2 | C1.2 R11.1 | C1.2 64.35,58.76 65.53,59.94 J6.2 71.12,59.94 74.93,63.75 74.93,66.04 77.22,68.33 78.86,68.33 U$13.2(AN)
N$32
  Top 0.813: F3.2 121.41,91.95 113.79,84.33 IC4.2 105.92,84.33 105.54,84.71 | C15.2 105.41,84.84 105.54,84.71 | C16.1 102.62,81.79 105.54,84.71
N$33
  Top 0.406: R12.1 64.6,69.85 C18.2 67.14,70.02 68.58,68.58 J7.2
N$34
  Top 0.813: U$9.COM 112.86,54.52 115.57,51.82 120.09,51.82 J2.3
N$35
  Top 0.813: PD1.+ F2.2
N$36
  Top 0.406: R26.2 50.63,28.87 U$14.2
N$37
  Top 0.406: R12.2 56.48,69.85 R13.2 53.77,69.76 R14.2
N$38
  Top 0.406: R15.1 70.87,46.14 C19.2 73.33,42.76 T1.1
N$39
  Top 0.813: 77.21,43.68 77.45,43.43 LED4.K 86.7,43.43 U$9.C2 | 77.21,43.68 D4.A | T1.3 75.98,42.45 77.21,43.68
N$40
  Top 0.406: R17.1 70.61,29.38 C33.2 72.82,26 T2.1
N$41
  Top 0.406: *R17.2 69.17,46.14 R15.2 | *R17.2 R21.1 C25.2 62.06,42.93 U$11.6 | R16.2 *R17.2
N$42
  Top 0.406: LED2.C R20.2
N$43
  Top 0.406: IC1.1 31.32,80.26 R18.2 34.46,80.68 35.81,82.04 35.81,82.46 R19.1
N$44
  Top 0.406: IC1.3 37.57,84.61 38.61,83.57 40.04,83.57 C21.2 | C21.2 43.09,83.48 U$10.+ | C21.2 40.13,82.68 C20.2
N$45
  Top 0.813: PD2.- 82.03,136.15 F5.1
N$46
  Top 0.813: J3.4 120.14,19.22 R10.1
N$47
  Top 0.813: U$13.6(VO) U$13.7(VO) 91.3,68.19 94.61,64.89 | 94.61,64.89 D8.C | R22.1 95.67,65.95 94.61,64.89
N$48
  Top 0.406: R25.2 *R1.2 | *R1.2 68.91,29.38 R17.2 | *R1.2 R23.1 C31.2 62.06,26.16 U$14.6
N$49
  Top 0.406: U$11.2 47.92,45.47 R30.2
N$50
  Top 0.813: R24.2 81.11,46.06 LED4.A
N$51
  Top 0.813: R31.1 99.15,64.59 D8.A
N$52
  Top 0.406: R27.2 LED7.K
N$53
  Top 0.813: D9.C 109.73,66.29 113.28,69.85 D10.C
N$54
  Top 0.406: LED5.K R28.2
N$55
  Top 0.406: LED6.K R29.2
N$56  (via drill 0.61)
  Top 0.254: 79.38,130.94 PD2.+
  Top 0.813: 79.38,130.94 v82.55,130.94
  Bottom 0.813: v82.55,130.94 82.55,130.05 87.88,124.71 87.88,122.68 90.17,120.4 99.57,120.4 110.74,109.22 116.84,109.22 121.41,104.65 F3.1
N$57
  pour Top (isolate 1.27): 0.25,142.75 131.06,142.75 131.06,0 0.25,0
N$58
  pour Bottom (isolate 1.27): 0.51,142.49 130.81,142.49 130.81,0.51 130.81,0 0.25,0 0.25,142.49
N$59
  Top 0.813: R32.2 108.97,89.66 109.47,89.15 IC4.1
N$60
  Top 0.813: R33.1 IC2.1
RST
  Top 0.406: R4.2 27.94,62.23 28.7,61.47 | 28.7,61.47 28.7,60.78 U1.1 | U$4.2 33.92,65.67 29.72,61.47 28.7,61.47
RX
  Top 0.406: U$4.4 37.92,60.97 U1.28
S_CMD
  Top 0.406: U$2.6 63.84,10.16 C13.2 R2.1 64.17,13.21 65.02,13.21 66.04,14.22 66.04,17.53 63.25,20.32 49.02,20.32 43.94,25.4 43.94,48.51 40.77,51.69 U1.21
SER_RES_RELAY
  Top 0.406: R26.1 48.26,41.15 46.23,43.18 46.23,51.31 43.18,54.36 37.66,54.36 U1.23
TEMP  (via drill 0.61)
  Top 0.254: v52.07,68.07 52.07,69.34 R14.1 | v39.37,52.83 38.1,52.83 U1.22
  Bottom 0.254: v52.07,68.07 39.37,55.37 v39.37,52.83
TX
  Top 0.406: U$4.3 35.92,64.88 32.77,61.72 32.77,60.71 34.04,59.44 37.41,59.44 U1.27
VCC  (via drill 0.6)
  Top 0.254: 43.18,17.78 43.18,45.85 38.73,50.29 38.1,50.29 U1.20
  Top 0.406: C23.2 C24.2 C22.2 | C22.2 22.1,84.55 LED2.A | IC1.4 33.95,82.3 R19.2 | v24.89,73.66 31.92,66.63 U$4.1 29.68,64.1 R4.1 27.85,64.01 26.42,64.01 25.4,62.99 C9.2 25.23,53.59 21.34,53.59 17.78,50.04 17.78,30.23 | IC1.4 24.84,79.05 v24.89,78.99 | C22.2 24.17,81.62 IC1.4 | U$2.8 U$2.7 | U$2.8 59.02,15.41 C14.2 58.93,17.61 58.93,18.8 58.67,19.05 51.05,19.05 49.78,17.78 43.18,17.78 LED6.A LED5.A LED7.A 15.75,17.78 13.97,19.56 13.97,26.42 17.78,30.23 | U$2.8 63.84,15.24 R2.2 | U$6.1 36.15,36.91 34.54,35.31 22.86,35.31 17.78,30.23 | J7.1 72.39,66.04 74.93,68.58 74.93,71.12 71.37,74.68 v52.83,74.68
  Bottom 0.406: v24.89,78.99 v24.89,73.66 25.91,74.68 v52.83,74.68

### Text on the board
Top: VS-Corp